# Altium schematic sheet LAB_Block.SchDoc
size A0; SheetNumber: 1; SheetTotal: 1
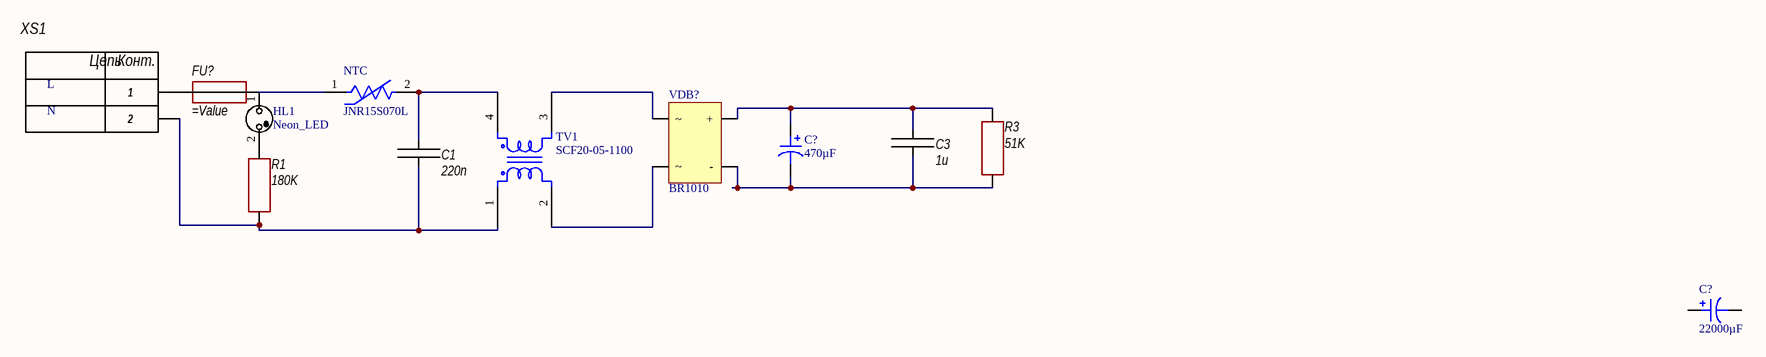
[diagram p0: LAB_Block.SchDoc]

## Parts
(Parts that share a designator on the sheet are numbered #1, #2 ... from top to bottom, then left to right.)
C1  220n  [Конд_плен]
C3  1u  [Конд_плен]
C?#1  470µF  [CAP TH ALUM ELEC D35.00mm S10.00mm H32.00mm]
C?#2  22000µF  [CAP TH ALUM ELEC D35.00mm S10.00mm H42.00mm]
FU?  (no value)  [C2-23-0,125]
HL1  Neon_LED  [2 PIN]
NTC  JNR15S070L  [FP-NTPAA-MFG]
R1  180K  [C2-23-0,125]
R3  51K  [C2-23-2]
TV1  SCF20-05-1100  [синфазный дросель FL2D-A2-202]
VDB?  BR1010
XS1  переменка  [5мм]  (value not drawn)

## Nets
NetC1_1: C1.1 R1.1 TV1.1 XS1.2
NetC1_2: C1.2 NTC.2 TV1.4
NetC3_1: C3.1 C?#1.2 R3.1 VDB?.4(-)
NetC3_2: C3.2 C?#1.1 R3.2 VDB?.1(+)
NetFU?_1: FU?.1 XS1.1
NetFU?_2: FU?.2 HL1.1 NTC.1
NetHL1_2: HL1.2 R1.2
NetTV1_2: TV1.2 VDB?.3
NetTV1_3: TV1.3 VDB?.2

Not connected (* = marked no-connect by the designer): C?#2 1 2

## Notes on the sheet
- L
- N
- (in symbol XS-2) Конт.; Цепь

## Library data of the parts
C1 C3 = Конденсатор
C?#1 = LLG2G471MELC30: CAP ALUM 470UF 20% 400V SNAP; manufacturer: Nichicon; Lifetime @ Temp.: 2000 Hrs @ 85°C; Polarization: Polar; Ripple Current @ High Frequency: 3.0459A @ 50kHz; Ripple Current @ Low Frequency: 2.13A @ 120Hz; Part Number: LLG2G471MELC30; Applications: General Purpose; Capacitance: 470µF; componentlink1description: Datasheet; componentlink1url: http://nichicon-us.com/english/products/pdfs/e-llg.pdf; componentlink2description: DigiKey Link; componentlink2url: http://digikey.com/product-detail/en/nichicon/LLG2G471MELC30/493-6107-ND/3439279; Device Package: Radial, Can - Snap-In; Height - Seated (Max): 1.260" (32.00mm); lastupdated: 13.09.2020 9:21:57; Lead Spacing: 0.394" (10.00mm); Lifecycle Status: Active; Minimum Order: 1; Mounting Type: Through Hole; Operating Temperature: -25°C ~ 85°C; Package / Case: Radial, Can - Snap-In; packaging: Bulk; partid: 26128; Part Status: Active; price: 7.75; series: LLG; Size / Dimension: 1.378" Dia (35.00mm); Supplier 1: DigiKey; Supplier Part Number 1: 493-6107-ND; Tolerance: ±20%; value: 470µF; Voltage - Rated: 400V
C?#2 = 35USG22000MEFCSN35X40: CAP ALUM 22000UF 20% 35V SNAP; manufacturer: Rubycon; Lifetime @ Temp.: 3000 Hrs @ 85°C; Polarization: Polar; Ripple Current @ High Frequency: 7.337A @ 100kHz; Ripple Current @ Low Frequency: 6.38A @ 120Hz; Part Number: 35USG22000MEFCSN35X40; Applications: General Purpose; Capacitance: 22000µF; componentlink1description: Datasheet; componentlink1url: http://www.rubycon.co.jp/en/catalog/e_pdfs/aluminum/e_USG.pdf; componentlink2description: DigiKey Link; componentlink2url: http://digikey.com/product-detail/en/rubycon/35USG22000MEFCSN35X40/1189-3913-ND/6827429; Device Package: Radial, Can - Snap-In; Height - Seated (Max): 1.654" (42.00mm); lastupdated: 29.09.2020 1:08:38; Lead Spacing: 0.394" (10.00mm); Lifecycle Status: Active; Minimum Order: 1; Mounting Type: Through Hole; Operating Temperature: -40°C ~ 85°C; Package / Case: Radial, Can - Snap-In; packaging: Bulk; partid: 26470; Part Status: Active; price: 5.68; series: USG; Size / Dimension: 1.378" Dia (35.00mm); Supplier 1: DigiKey; Supplier Part Number 1: 1189-3913-ND; Tolerance: ±20%; value: 22000µF; Voltage - Rated: 35V
FU? = Предохранитель
NTC = CMP-06022-000093-1: ICL 8.2 OHM 15% 2A 10MM; Lead Diameter: 0.8mm; Voltage: 264V; Resistance: 8.2R; Packaging: Bulk; Package Quantity: 100; Width: 5mm; Diameter: 0.394inch; Tolerance: 15%; Lead Free: Lead Free; Min Operating Temperature: -20°C; Mount: Through Hole; Number of Pins: 2; Current Rating: 2A; Thickness: 5mm; Lead Pitch: 0.295inch; Radiation Hardening: No; Max Operating Temperature: 160°C; Depth: 5mm
R1 R3 = Резистор
TV1 = SCF20-05-1100: COMMON MODE CHOKE 11MH 5A 2LN TH; Manufacturer: KEMET; DC Resistance (DCR) (Max): 39mOhm; Filter Type: Power Line; Inductance @ Frequency: 11mH @ 10kHz; Number of Lines: 2; Voltage Rating - AC: 250V; Part Number: SCF20-05-1100; ComponentLink1Description: Datasheet; ComponentLink1URL: https://api.kemet.com/component-edge/download/datasheet/SCF20-05-1100.pdf; ComponentLink2Description: DigiKey Link; ComponentLink2URL: http://digikey.com/product-detail/en/kemet/SCF20-05-1100/399-10779-ND/4290845; Current Rating (Max): 5A; Height (Max): 0.984" (25.00mm); LastUpdated: 19.08.2023 17:49:53; Lifecycle Status: Active; Minimum Order: 1; Mounting Type: Through Hole; Operating Temperature: -25°C ~ 120°C; Package / Case: Vertical, No Base, 4 PC Pin; Packaging: Bulk; Part Status: Active; Price: 7.23; Series: SC; Size / Dimension: 0.984" L x 0.610" W (25.00mm x 15.50mm); Supplier 1: DigiKey; Supplier Part Number 1: 399-10779-ND; Voltage Rating - DC: 250V
XS1 = XS-2